# Altium schematic sheet Power_Monitor.SchDoc: Battery and Charger Breakouts
size A; Date: Dec 27, 2017; DrawnBy: Seyed Omid Hasanli; Revision: 1.0; SheetNumber: 12
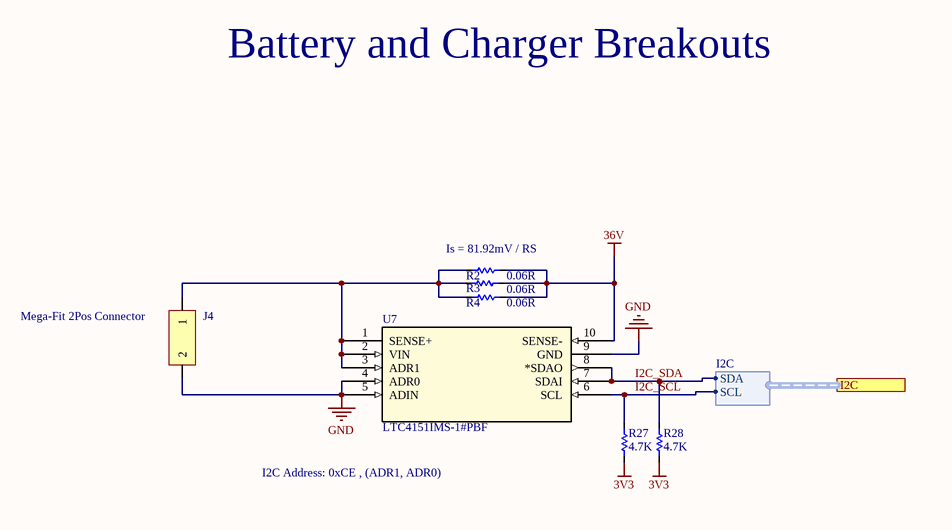
[diagram p0: Power_Monitor.SchDoc]

## Parts
J4  Mega-Fit 2Pos Connector  [MegaFit-2Pos]
R2  value 0.06R  [0402]  (hidden comment: Res)
R3  value 0.06R  [0402]  (hidden comment: Res)
R4  value 0.06R  [0402]  (hidden comment: Res)
R27  value 4.7K  [0603]  (hidden comment: Res)
R28  value 4.7K  [0603]  (hidden comment: Res)
U7  LTC4151IMS-1#PBF  [MSOP-10_MS]

## Ports
I2C (harness I2C)

## Harnesses
I2C: SCL, SDA

## Nets
3V3: R27.1 R28.1
36V: R2.2 R3.2 R4.2 U7.10(SENSE-)
GND: J4.2 U7.4(ADR0) U7.5(ADIN) U7.9(GND)
I2C_SCL: R27.2 U7.6(SCL) ; port I2C.SCL
I2C_SDA: R28.2 U7.7(SDAI) U7.8(*SDAO) ; port I2C.SDA
NetJ4_1: J4.1 R2.1 R3.1 R4.1 U7.1(SENSE+) U7.2(VIN) U7.3(ADR1)

## Notes on the sheet
- Battery and Charger Breakouts
- (near R2) Is = 81.92mV / RS
- I2C Address: 0xCE , (ADR1, ADR0)
- Title:
- DrawnBy:
- Revision:
- SheetNumber:
- Date:
- Datasheet Link:

## Library data of the parts
J4 = Mega-Fit 2Pos: Molex MegaFit 2-Pos Connector; URL: https://www.digikey.com/product-detail/en/molex-llc/0768290010/WM11979-ND/5639621; DigiKey PN: WM11979-ND
U7 = LTC4151IMS-1#PBF: Imported; Vendor: Linear Technology; C: Copyright (C) 2016 Accelerated Designs. All rights reserved; Manufacturer_Part_Number: ltc4151ims-1#pbf; Copyright: Copyright (C) 2016 Accelerated Designs. All rights reserved; Value: Value; Type: Type; RefDes: RefDes